# EAGLE schematic main_schematic (EAGLE 9.3.0)
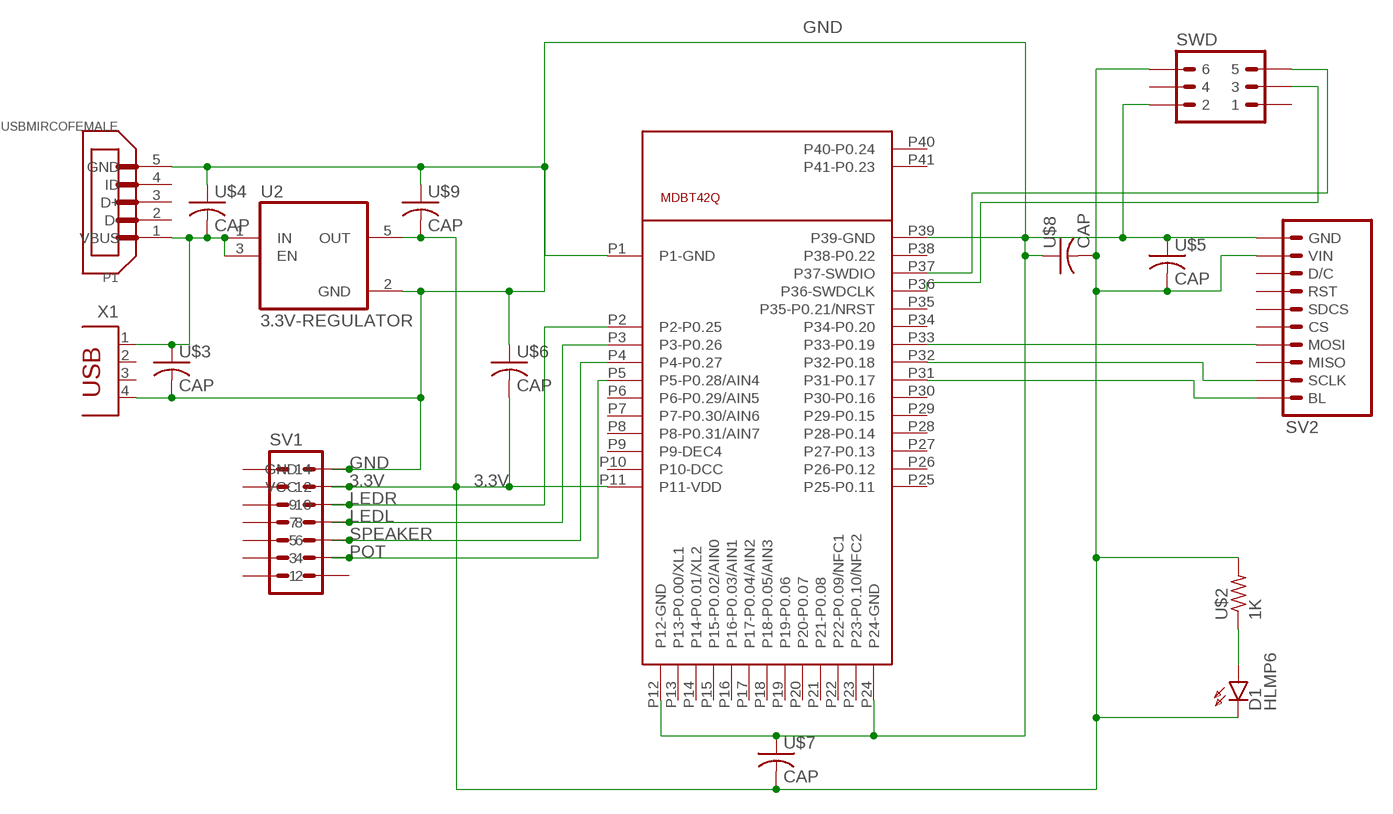
[diagram p0: schematic, sheet 1]

## Parts
D1  HLMP6  [HLMP6]
P1  USBMIRCOFEMALE  [MOLEX_0473460001]
SV1  MISCHEADER  [MA07-2]
SV2  LCDHEADERS  [MA10-1]
SWD  DEBUGGER  [MA03-2]
U2  3.3V-REGULATOR  [SOT95P280X145-5N]
U$1  MDBT42Q  [MDBT40]
U$2  1K  RESISTOR  [M1206]
U$3  CAP  [C1206]
U$4  CAP  [C1206]
U$5  CAP  [C1206]
U$6  CAP  [C1206]
U$7  CAP  [C1206]
U$8  CAP  [C1206]
U$9  CAP  [C1206]
X1  USBCON  [PN87520]

## Nets
3.3V: D1.K SV1.11(VCC) SV2.2(VIN) SWD.6 U2.5(OUT) U$1.P11(P11-VDD) U$2.2 U$5.2 U$6.2 U$7.2 U$8.2 U$9.2
5V: P1.1(VBUS) U2.1(IN) U2.3(EN) U$3.1 U$4.2 X1.1
GND: P1.5(GND) SV1.13(GND) SV2.1(GND) SWD.2 U2.2(GND) U$1.P1(P1-GND) U$1.P12(P12-GND) U$1.P24(P24-GND) U$1.P39(P39-GND) U$3.2 U$4.1 U$5.1 U$6.1 U$7.1 U$8.1 U$9.1 X1.4
LEDL: SV1.7 U$1.P3(P3-P0.26)
LEDR: SV1.9 U$1.P2(P2-P0.25)
N$1: SV2.7(MOSI) U$1.P33(P33-P0.19)
N$3: D1.A U$2.1
N$4: SV2.9(SCLK) U$1.P32(P32-P0.18)
N$5: SV2.10(BL) U$1.P31(P31-P0.17)
N$6: SWD.5 U$1.P37(P37-SWDIO)
N$7: SWD.3 U$1.P36(P36-SWDCLK)
POT: SV1.3 U$1.P5(P5-P0.28/AIN4)
SPEAKER: SV1.5 U$1.P4(P4-P0.27)
Unconnected: P1.2(D-) P1.3(D+) P1.4(ID) SV1.1 SV1.2 SV1.4 SV1.6 SV1.8 SV1.10 SV1.12 SV1.14 SV2.3(D/C) SV2.4(RST) SV2.5(SDCS) SV2.6(CS) SV2.8(MISO) SWD.1 SWD.4 U$1.P6(P6-P0.29/AIN5) U$1.P7(P7-P0.30/AIN6) U$1.P8(P8-P0.31/AIN7) U$1.P9(P9-DEC4) U$1.P10(P10-DCC) U$1.P13(P13-P0.00/XL1) U$1.P14(P14-P0.01/XL2) U$1.P15(P15-P0.02/AIN0) U$1.P16(P16-P0.03/AIN1) U$1.P17(P17-P0.04/AIN2) U$1.P18(P18-P0.05/AIN3) U$1.P19(P19-P0.06) U$1.P20(P20-P0.07) U$1.P21(P21-P0.08) U$1.P22(P22-P0.09/NFC1) U$1.P23(P23-P0.10/NFC2) U$1.P25(P25-P0.11) U$1.P26(P26-P0.12) U$1.P27(P27-P0.13) U$1.P28(P28-P0.14) U$1.P29(P29-P0.15) U$1.P30(P30-P0.16) U$1.P34(P34-P0.20) U$1.P35(P35-P0.21/NRST) U$1.P38(P38-P0.22) U$1.P40(P40-P0.24) U$1.P41(P41-P0.23) X1.2 X1.3

## Library data of the parts
D1 = display-hp:HLMP6: LED 2mm horizontal; MF: AGILENT TECHNOLOGIES; MPN: HLMP-6500; OC_FARNELL: 1652490; OC_NEWARK: 40K0088
P1 = third_eye:USBMIRCOFEMALE: Conn Micro USB Type B RCP 5 POS 0.65mm Solder RA SMD 5 Terminal 1 Port T/R; AVAILABILITY: Unavailable; DESCRIPTION: Conn Micro USB Type B RCP 5 POS 0.65mm Solder RA SMD 5 Terminal 1 Port T/R; MF: Weidmuller; MP: 0473460001; PACKAGE: None; PRICE: None
SV1 = third_eye:MISCHEADER: PIN HEADER; OC_FARNELL: unknown; OC_NEWARK: unknown
SV2 = third_eye:LCDHEADERS: PIN HEADER; OC_FARNELL: unknown; OC_NEWARK: unknown
SWD = third_eye:DEBUGGER: PIN HEADER; OC_FARNELL: unknown; OC_NEWARK: unknown
U2 = third_eye:3.3V-REGULATOR: 500mA Low-IQ Small-Size Low-Dropout (LDO) Regulator 5-SOT-23 -40 to 125; AVAILABILITY: Unavailable; DESCRIPTION: 500mA Low-IQ Small-Size Low-Dropout _LDO_ Regulator 5-SOT-23 -40 to 125; MF: Texas Instruments; MP: TLV75533PDBVR; PACKAGE: SOT-23 Texas Instruments; PRICE: None
U$1 = third_eye:MDBT42Q
U$2 = third_eye:RESISTOR
U$3-U$9 = third_eye:CAP
X1 = third_eye:USBCON: BERG USB connector; OC_FARNELL: unknown; OC_NEWARK: unknown